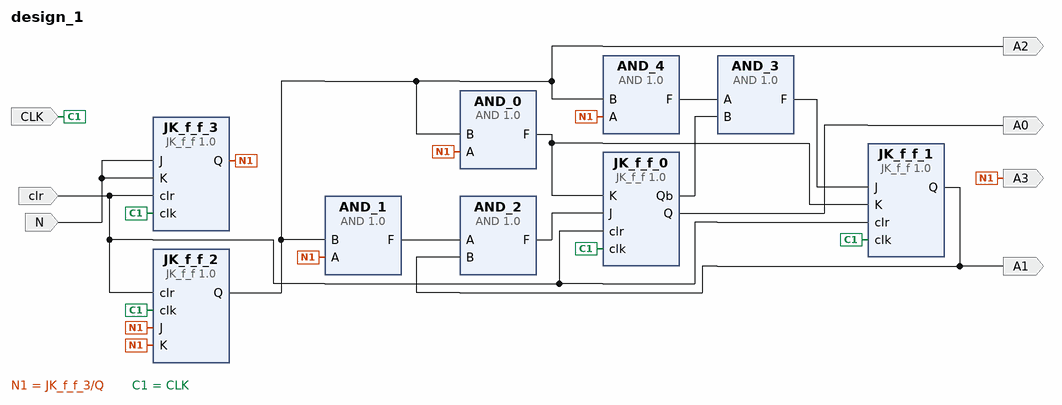
[diagram p0: block diagram of the top level]
# Vivado block design design_1, xc7a35tcsg324-1, Vivado 2017.1
create_bd_design design_1

create_bd_port -dir I N
create_bd_port -dir I CLK
create_bd_port -dir I clr
create_bd_port -dir O A0
create_bd_port -dir O A1
create_bd_port -dir O A2
create_bd_port -dir O A3

create_bd_cell -type ip -vlnv xilinx.com:user:JK_f_f:1.0 JK_f_f_0
create_bd_cell -type ip -vlnv xilinx.com:user:JK_f_f:1.0 JK_f_f_1
create_bd_cell -type ip -vlnv xilinx.com:user:JK_f_f:1.0 JK_f_f_2
create_bd_cell -type ip -vlnv xilinx.com:user:JK_f_f:1.0 JK_f_f_3
create_bd_cell -type ip -vlnv xilinx.com:user:AND:1.0 AND_0
create_bd_cell -type ip -vlnv xilinx.com:user:AND:1.0 AND_1
create_bd_cell -type ip -vlnv xilinx.com:user:AND:1.0 AND_2
create_bd_cell -type ip -vlnv xilinx.com:user:AND:1.0 AND_3
create_bd_cell -type ip -vlnv xilinx.com:user:AND:1.0 AND_4

# ---- connections ----

connect_bd_net [get_bd_pins AND_0/F] [get_bd_pins JK_f_f_0/K] [get_bd_pins JK_f_f_1/K]
connect_bd_net [get_bd_pins JK_f_f_3/Q] \
  [get_bd_pins AND_0/A] [get_bd_pins AND_1/A] [get_bd_pins AND_4/A] [get_bd_pins JK_f_f_2/K] [get_bd_pins JK_f_f_2/J] \
  [get_bd_ports A3]
connect_bd_net [get_bd_pins JK_f_f_2/Q] [get_bd_pins AND_0/B] [get_bd_pins AND_1/B] [get_bd_pins AND_4/B] [get_bd_ports A2]
connect_bd_net [get_bd_pins AND_2/F] [get_bd_pins JK_f_f_0/J]
connect_bd_net [get_bd_pins AND_1/F] [get_bd_pins AND_2/A]
connect_bd_net [get_bd_pins JK_f_f_1/Q] [get_bd_pins AND_2/B] [get_bd_ports A1]
connect_bd_net [get_bd_pins AND_3/F] [get_bd_pins JK_f_f_1/J]
connect_bd_net [get_bd_pins AND_4/F] [get_bd_pins AND_3/A]
connect_bd_net [get_bd_pins JK_f_f_0/Qb] [get_bd_pins AND_3/B]
connect_bd_net [get_bd_ports N] [get_bd_pins JK_f_f_3/J] [get_bd_pins JK_f_f_3/K]
connect_bd_net [get_bd_ports CLK] [get_bd_pins JK_f_f_0/clk] [get_bd_pins JK_f_f_1/clk] [get_bd_pins JK_f_f_2/clk] [get_bd_pins JK_f_f_3/clk]
connect_bd_net [get_bd_ports clr] [get_bd_pins JK_f_f_0/clr] [get_bd_pins JK_f_f_1/clr] [get_bd_pins JK_f_f_2/clr] [get_bd_pins JK_f_f_3/clr]
connect_bd_net [get_bd_pins JK_f_f_0/Q] [get_bd_ports A0]

validate_bd_design
save_bd_design
